# Altium project doan2.PrjPcb
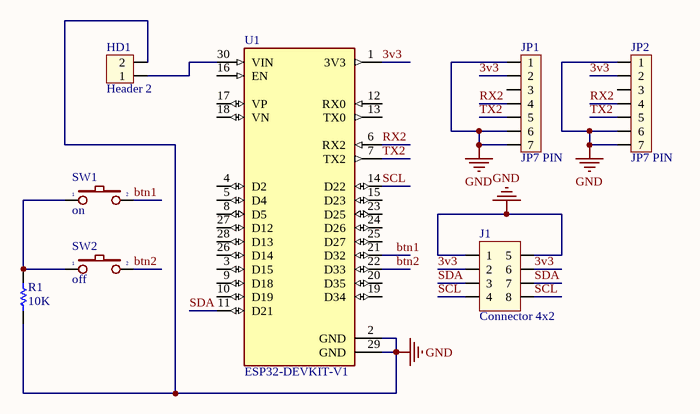
[diagram p0: esp32_master.SchDoc]
1 sheet, 8 parts. Net scope: global (net labels, ports and power ports of the same name join across sheets).
Board file: esp32_master.PcbDoc

## Sheet esp32_master.SchDoc
size A; SheetNumber: 1; SheetTotal: 1

### Parts
HD1  Header 2  [HED2]
J1  Connector 4x2  [JP4x2]
JP1  JP7 PIN  [JP7]
JP2  JP7 PIN  [JP7]
R1  value 10K  [R1/4W]  (hidden comment: Res1)
SW1  on  [SW2]
SW2  off  [SW2]
U1  ESP32-DEVKIT-V1  [MODULE_ESP32_DEVKIT_V1]

### Nets
GND: HD1.2 J1.1 J1.5 JP1.1 JP1.6 JP1.7 JP2.1 JP2.6 JP2.7 R1.2 U1.2(GND) U1.29(GND)
3v3: J1.2 J1.6 JP1.2 JP2.2 U1.1(3V3)
btn1: SW1.2 U1.21(D32)
btn2: SW2.2 U1.22(D33)
RX2: JP1.4 JP2.4 U1.6(RX2)
SCL: J1.4 J1.8 U1.14(D22)
SDA: J1.3 J1.7 U1.11(D21)
TX2: JP1.5 JP2.5 U1.7(TX2)
NetHD1_1: HD1.1 U1.30(VIN)
NetR1_1: R1.1 SW1.1 SW2.1

Not connected (* = marked no-connect by the designer): JP1 3; JP2 3; U1 3(D15) 4(D2) 5(D4) 8(D5) 9(D18) 10(D19) 12(RX0) 13(TX0) 15(D23) 16(EN) 17(VP) 18(VN) 19(D34) 20(D35) 23(D25) 24(D26) 25(D27) 26(D14) 27(D12) 28(D13)

### Library data of the parts
HD1 = Hed2: Header 2 (Green); Value: Header 2
J1 = JP4x2: Value: Connector 4x2
JP1 JP2 = JP7: Value: JP7
R1 = Res1_1: Resistor; Manufacturer: Generic Components; Class: Passive; Published: 08/06/2000; Publisher: Altium Hobart Technology Centre; SubClass: Resistor
SW1 SW2 = SW2: Switch button 2 pin; Value: SW chip 2 pin
U1 = ESP32-DEVKIT-V1: Dual core, Wi-Fi: 2.4 GHz up to 150 Mbits/s,BLE (Bluetooth Low Energy) and legacy Bluetooth, 32 bits, Up to 240 MHz; MF: Do it; SnapEDA_Link: https://www.snapeda.com/parts/ESP32-DEVKIT-V1/Do+it/view-part/?ref=snap; Package: None; Value: *; MP: ESP32-DEVKIT-V1; Check_prices: https://www.snapeda.com/parts/ESP32-DEVKIT-V1/Do+it/view-part/?ref=eda